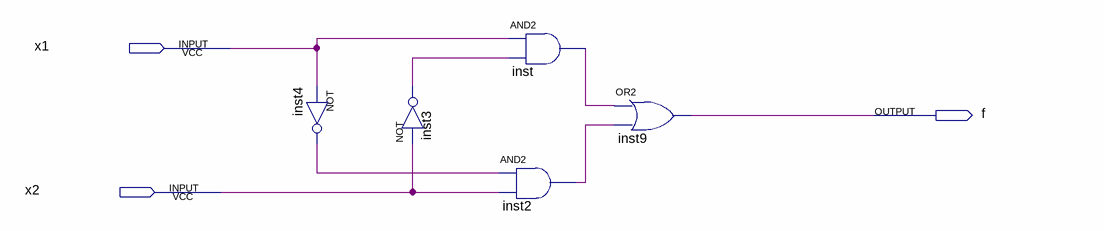
[diagram p0: schematic sheet]
// Quartus schematic Part2.bdf as structural Verilog: 5 symbols, 3 pins
module Part2 (
  input  x1,
  input  x2,
  output f
);

  wire inst2_out, inst3_out, inst4_out, inst_out;

  not inst4 (inst4_out, x1);
  not inst3 (inst3_out, x2);
  and inst (inst_out, x1, inst3_out);
  and inst2 (inst2_out, inst4_out, x2);
  or inst9 (f, inst_out, inst2_out);
endmodule
